# Altium schematic sheet [05] - CPU - HDMI, LVDS.SchDoc
size A2; DocumentNumber: 5; SheetNumber: 5; SheetTotal: 32
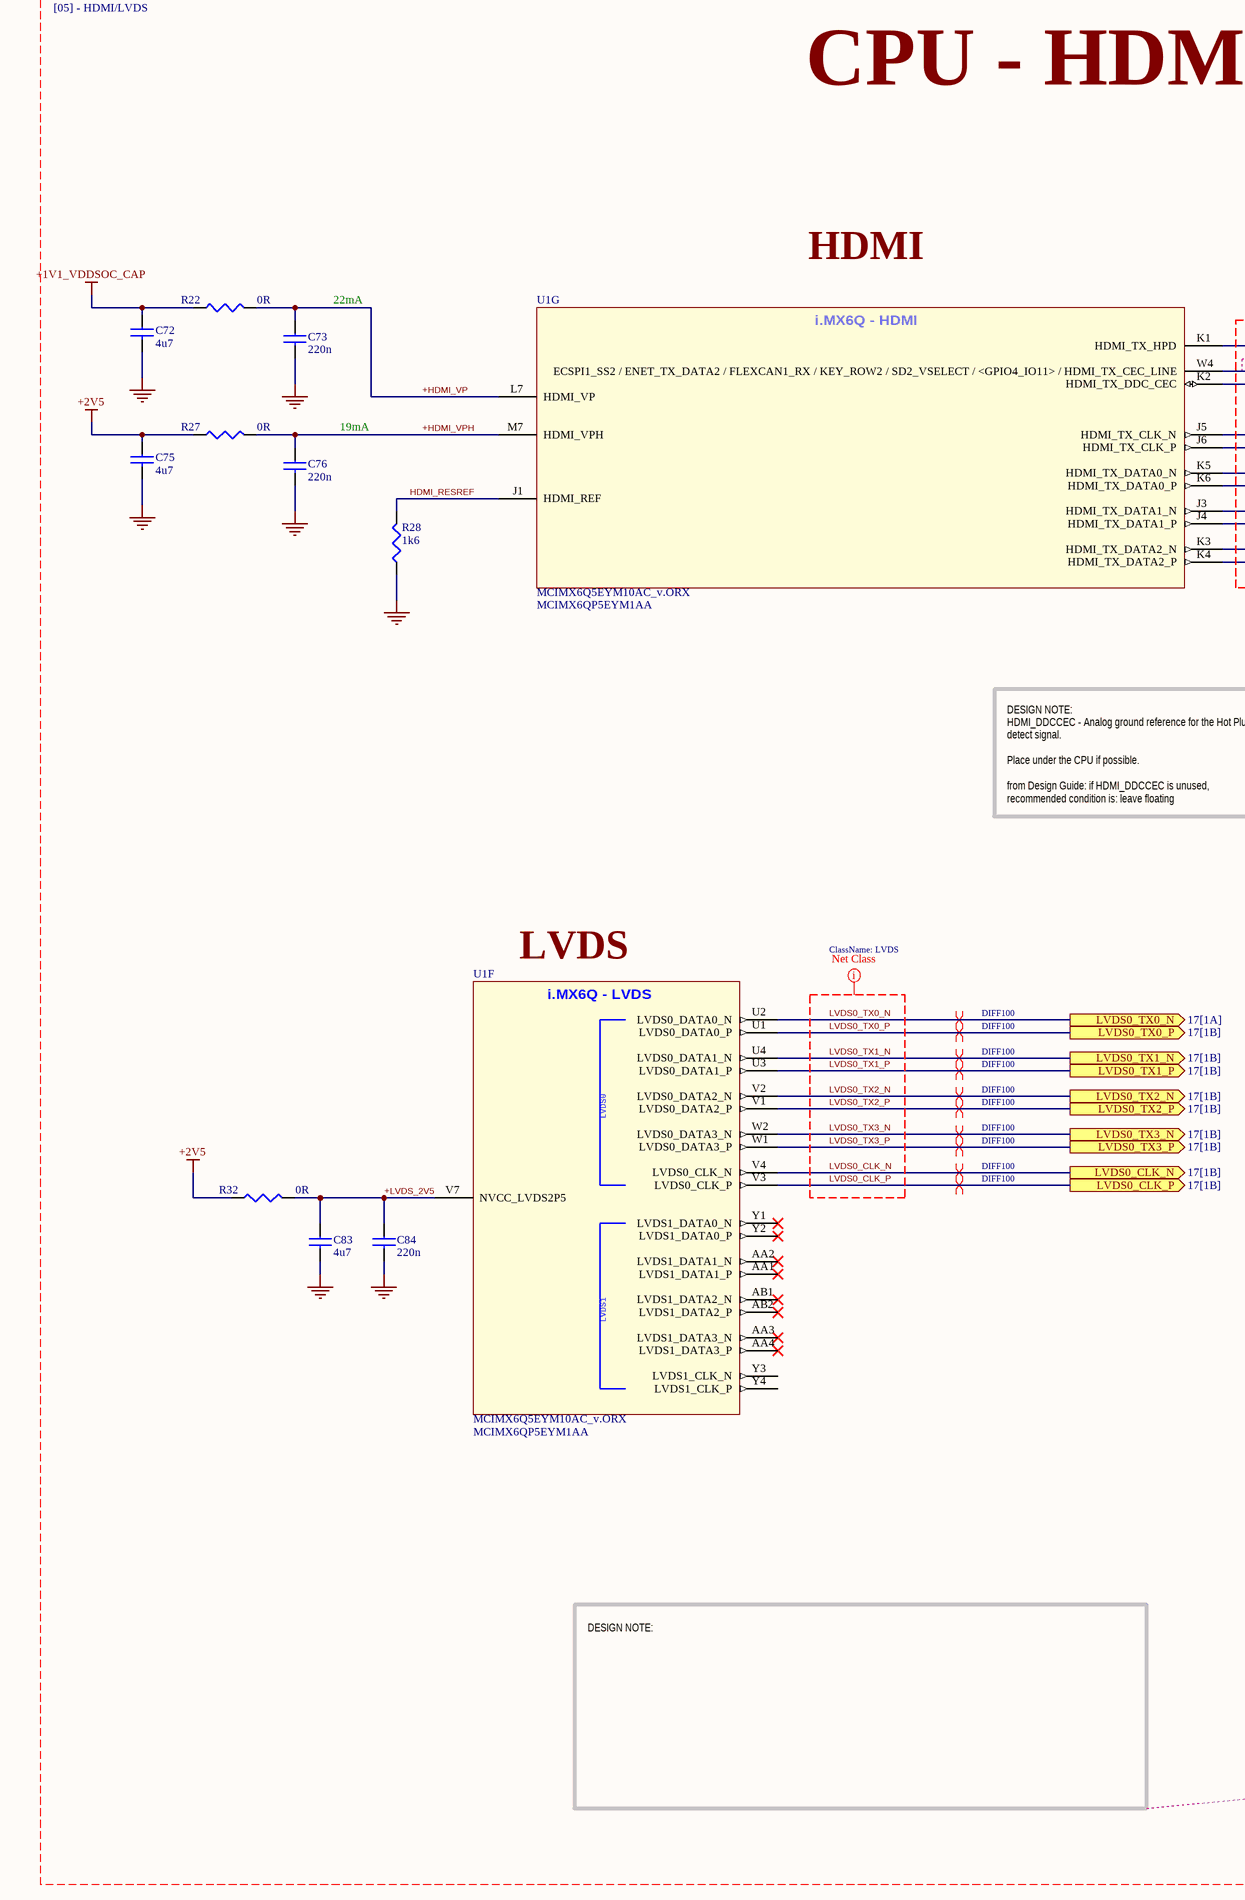
[diagram p0: [05] - CPU - HDMI, LVDS.SchDoc, left]
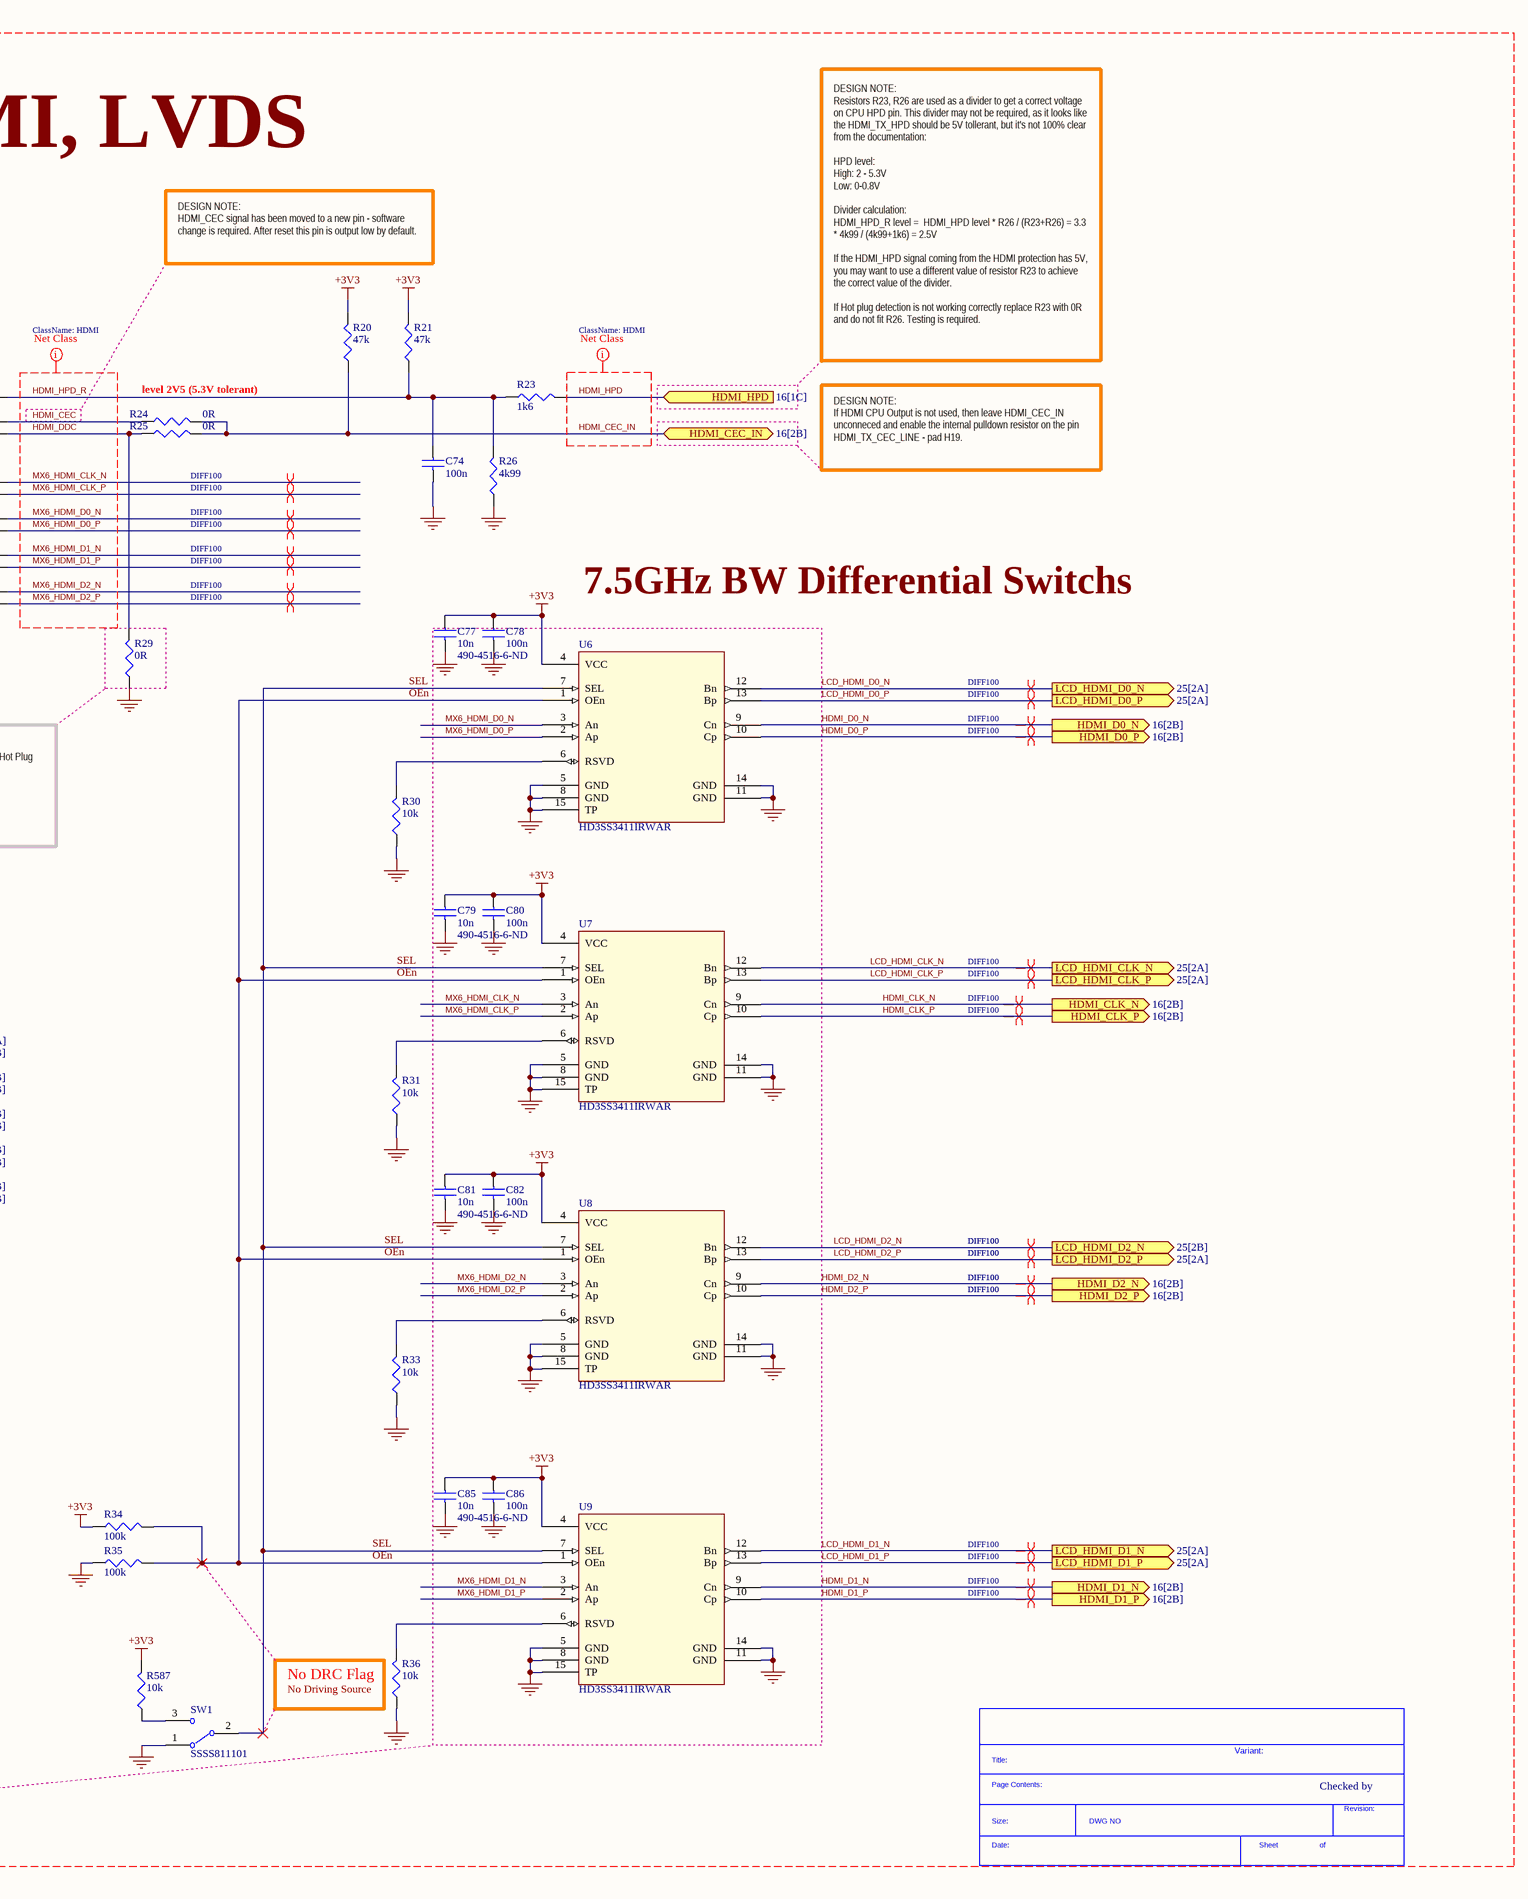
[diagram p1: [05] - CPU - HDMI, LVDS.SchDoc, right]

## Parts
*  SDTitleBlock  (value not drawn)  (graphical)
C72  4u7  [C0402]
C73  220n  [C0201]
C74  100n  [C0402]
C75  4u7  [C0402]
C76  220n  [C0201]
C77  10n  Supplier Part Number 2: 490-4516-6-ND  [C0402]
C78  100n  [C0402]
C79  10n  Supplier Part Number 2: 490-4516-6-ND  [C0402]
C80  100n  [C0402]
C81  10n  Supplier Part Number 2: 490-4516-6-ND  [C0402]
C82  100n  [C0402]
C83  4u7  [C0402]
C84  220n  [C0201]
C85  10n  Supplier Part Number 2: 490-4516-6-ND  [C0402]
C86  100n  [C0402]
R20  47k  [R0402]
R21  47k  [R0402]
R22  0R  [R0402]
R23  1k6  [R0402]
R24  0R  [R0402]
R25  0R  [R0402]
R26  4k99  [R0402]
R27  0R  [R0402]
R28  1k6  [R0201]
R29  0R  [R0402]
R30  10k  [R0201]
R31  10k  [R0201]
R32  0R  [R0402]
R33  10k  [R0201]
R34  100k  [R0402]
R35  100k  [R0402]
R36  10k  [R0201]
R587  10k  [R0201]
SW1  SSSS811101  [SSSS811101]
U1  MCIMX6Q5EYM10AC_v.ORX  Supplier Part Number 2: MCIMX6QP5EYM1AA  [PBGA624]  (parts F,G of 23)
U6  HD3SS3411IRWAR  [QFN50P330X330X80_HS-15N]
U7  HD3SS3411IRWAR  [QFN50P330X330X80_HS-15N]
U8  HD3SS3411IRWAR  [QFN50P330X330X80_HS-15N]
U9  HD3SS3411IRWAR  [QFN50P330X330X80_HS-15N]

## Ports
HDMI_CEC_IN (bidir, see 16[2B]), HDMI_CLK_N (out, see 16[2B]), HDMI_CLK_P (out, see 16[2B]), HDMI_D0_N (out, see 16[2B]), HDMI_D0_P (out, see 16[2B]), HDMI_D1_N (out, see 16[2B]), HDMI_D1_P (out, see 16[2B]), HDMI_D2_N (out, see 16[2B]), HDMI_D2_P (out, see 16[2B]), HDMI_HPD (in, see 16[1C]), LCD_HDMI_CLK_N (out, see 25[2A]), LCD_HDMI_CLK_P (out, see 25[2A]), LCD_HDMI_D0_N (out, see 25[2A]), LCD_HDMI_D0_P (out, see 25[2A]), LCD_HDMI_D1_N (out, see 25[2A]), LCD_HDMI_D1_P (out, see 25[2A]), LCD_HDMI_D2_N (out, see 25[2B]), LCD_HDMI_D2_P (out, see 25[2A]), LVDS0_CLK_N (out, see 17[1B]), LVDS0_CLK_P (out, see 17[1B]), LVDS0_TX0_N (out, see 17[1A]), LVDS0_TX0_P (out, see 17[1B]), LVDS0_TX1_N (out, see 17[1B]), LVDS0_TX1_P (out, see 17[1B]), LVDS0_TX2_N (out, see 17[1B]), LVDS0_TX2_P (out, see 17[1B]), LVDS0_TX3_N (out, see 17[1B]), LVDS0_TX3_P (out, see 17[1B])

## Nets
+1V1_VDDSOC_CAP: C72.1 R22.1
+2V5: C75.1 R27.1 R32.1
+3V3: C77.1 C78.1 C79.1 C80.1 C81.1 C82.1 C85.1 C86.1 R20.2 R21.2 R34.1 R587.2 U6.4(VCC) U7.4(VCC) U8.4(VCC) U9.4(VCC)
GND: C72.2 C73.2 C74.2 C75.2 C76.2 C77.2 C78.2 C79.2 C80.2 C81.2 C82.2 C83.2 C84.2 C85.2 C86.2 R26.1 R28.1 R29.1 R30.1 R31.1 R33.1 R35.1 R36.1 SW1.1 U6.5(GND) U6.8(GND) U6.11(GND) U6.14(GND) U6.15(TP) U7.5(GND) U7.8(GND) U7.11(GND) U7.14(GND) U7.15(TP) U8.5(GND) U8.8(GND) U8.11(GND) U8.14(GND) U8.15(TP) U9.5(GND) U9.8(GND) U9.11(GND) U9.14(GND) U9.15(TP)
+HDMI_VP: C73.1 R22.2 U1.L7(HDMI_VP)
+HDMI_VPH: C76.1 R27.2 U1.M7(HDMI_VPH)
+LVDS_2V5: C83.1 C84.1 R32.2 U1.V7(NVCC_LVDS2P5)
HDMI_CEC: R24.1 U1.W4(ECSPI1_SS2_/_ENET_TX_DATA2_/_FLEXCAN1_RX_/_KEY_ROW2_/_SD2_VSELECT_/_<GPIO4_IO11>_/_HDMI_TX_CEC_LINE)
HDMI_CEC_IN: R20.1 R24.2 R25.2 ; port HDMI_CEC_IN
HDMI_CLK_N: U7.9(Cn) ; port HDMI_CLK_N
HDMI_CLK_P: U7.10(Cp) ; port HDMI_CLK_P
HDMI_D0_N: U6.9(Cn) ; port HDMI_D0_N
HDMI_D0_P: U6.10(Cp) ; port HDMI_D0_P
HDMI_D1_N: U9.9(Cn) ; port HDMI_D1_N
HDMI_D1_P: U9.10(Cp) ; port HDMI_D1_P
HDMI_D2_N: U8.9(Cn) ; port HDMI_D2_N
HDMI_D2_P: U8.10(Cp) ; port HDMI_D2_P
HDMI_DDC: R25.1 R29.2 U1.K2(HDMI_TX_DDC_CEC)
HDMI_HPD: R23.2 ; port HDMI_HPD
HDMI_HPD_R: C74.1 R21.1 R23.1 R26.2 U1.K1(HDMI_TX_HPD)
HDMI_RESREF: R28.2 U1.J1(HDMI_REF)
LCD_HDMI_CLK_N: U7.12(Bn) ; port LCD_HDMI_CLK_N
LCD_HDMI_CLK_P: U7.13(Bp) ; port LCD_HDMI_CLK_P
LCD_HDMI_D0_N: U6.12(Bn) ; port LCD_HDMI_D0_N
LCD_HDMI_D0_P: U6.13(Bp) ; port LCD_HDMI_D0_P
LCD_HDMI_D1_N: U9.12(Bn) ; port LCD_HDMI_D1_N
LCD_HDMI_D1_P: U9.13(Bp) ; port LCD_HDMI_D1_P
LCD_HDMI_D2_N: U8.12(Bn) ; port LCD_HDMI_D2_N
LCD_HDMI_D2_P: U8.13(Bp) ; port LCD_HDMI_D2_P
LVDS0_CLK_N: U1.V4(LVDS0_CLK_N) ; port LVDS0_CLK_N
LVDS0_CLK_P: U1.V3(LVDS0_CLK_P) ; port LVDS0_CLK_P
LVDS0_TX0_N: U1.U2(LVDS0_DATA0_N) ; port LVDS0_TX0_N
LVDS0_TX0_P: U1.U1(LVDS0_DATA0_P) ; port LVDS0_TX0_P
LVDS0_TX1_N: U1.U4(LVDS0_DATA1_N) ; port LVDS0_TX1_N
LVDS0_TX1_P: U1.U3(LVDS0_DATA1_P) ; port LVDS0_TX1_P
LVDS0_TX2_N: U1.V2(LVDS0_DATA2_N) ; port LVDS0_TX2_N
LVDS0_TX2_P: U1.V1(LVDS0_DATA2_P) ; port LVDS0_TX2_P
LVDS0_TX3_N: U1.W2(LVDS0_DATA3_N) ; port LVDS0_TX3_N
LVDS0_TX3_P: U1.W1(LVDS0_DATA3_P) ; port LVDS0_TX3_P
MX6_HDMI_CLK_N: U1.J5(HDMI_TX_CLK_N) U7.3(An)
MX6_HDMI_CLK_P: U1.J6(HDMI_TX_CLK_P) U7.2(Ap)
MX6_HDMI_D0_N: U1.K5(HDMI_TX_DATA0_N) U6.3(An)
MX6_HDMI_D0_P: U1.K6(HDMI_TX_DATA0_P) U6.2(Ap)
MX6_HDMI_D1_N: U1.J3(HDMI_TX_DATA1_N) U9.3(An)
MX6_HDMI_D1_P: U1.J4(HDMI_TX_DATA1_P) U9.2(Ap)
MX6_HDMI_D2_N: U1.K3(HDMI_TX_DATA2_N) U8.3(An)
MX6_HDMI_D2_P: U1.K4(HDMI_TX_DATA2_P) U8.2(Ap)
OEn: R34.2 R35.2 U6.1(OEn) U7.1(OEn) U8.1(OEn) U9.1(OEn)
SEL: SW1.2 U6.7(SEL) U7.7(SEL) U8.7(SEL) U9.7(SEL)
NetR30_2: R30.2 U6.6(RSVD)
NetR31_2: R31.2 U7.6(RSVD)
NetR33_2: R33.2 U8.6(RSVD)
NetR36_2: R36.2 U9.6(RSVD)
NetR587_1: R587.1 SW1.3

Not connected (* = marked no-connect by the designer): U1 AA1(LVDS1_DATA1_P)* AA2(LVDS1_DATA1_N)* AA3(LVDS1_DATA3_N)* AA4(LVDS1_DATA3_P)* AB1(LVDS1_DATA2_N)* AB2(LVDS1_DATA2_P)* Y1(LVDS1_DATA0_N)* Y2(LVDS1_DATA0_P)* Y3(LVDS1_CLK_N) Y4(LVDS1_CLK_P)

## Layout directives
differential pair; net class DIFF100: HDMI_CLK_N, HDMI_CLK_P, HDMI_D0_N, HDMI_D0_P, HDMI_D1_N, HDMI_D1_P, HDMI_D2_N, HDMI_D2_P, LCD_HDMI_CLK_N, LCD_HDMI_CLK_P, LCD_HDMI_D0_N, LCD_HDMI_D0_P, LCD_HDMI_D1_N, LCD_HDMI_D1_P, LCD_HDMI_D2_N, LCD_HDMI_D2_P, LVDS0_CLK_N, LVDS0_CLK_P, LVDS0_TX0_N, LVDS0_TX0_P, LVDS0_TX1_N, LVDS0_TX1_P, LVDS0_TX2_N, LVDS0_TX2_P, LVDS0_TX3_N, LVDS0_TX3_P, MX6_HDMI_CLK_N, MX6_HDMI_CLK_P, MX6_HDMI_D0_N, MX6_HDMI_D0_P, MX6_HDMI_D1_N, MX6_HDMI_D1_P, MX6_HDMI_D2_N, MX6_HDMI_D2_P
net class HDMI: HDMI_CEC, HDMI_CEC_IN, HDMI_DDC, HDMI_HPD, HDMI_HPD_R, MX6_HDMI_CLK_N, MX6_HDMI_CLK_P, MX6_HDMI_D0_N, MX6_HDMI_D0_P, MX6_HDMI_D1_N, MX6_HDMI_D1_P, MX6_HDMI_D2_N, MX6_HDMI_D2_P
net class [05] - HDMI/LVDS: +1V1_VDDSOC_CAP, +2V5, +3V3, +HDMI_VP, +HDMI_VPH, +LVDS_2V5, GND, HDMI_CEC, HDMI_CEC_IN, HDMI_CLK_N, HDMI_CLK_P, HDMI_D0_N, HDMI_D0_P, HDMI_D1_N, HDMI_D1_P, HDMI_D2_N, HDMI_D2_P, HDMI_DDC, HDMI_HPD, HDMI_HPD_R, HDMI_RESREF, LCD_HDMI_CLK_N, LCD_HDMI_CLK_P, LCD_HDMI_D0_N, LCD_HDMI_D0_P, LCD_HDMI_D1_N, LCD_HDMI_D1_P, LCD_HDMI_D2_N, LCD_HDMI_D2_P, LVDS0_CLK_N, LVDS0_CLK_P, LVDS0_TX0_N, LVDS0_TX0_P, LVDS0_TX1_N, LVDS0_TX1_P, LVDS0_TX2_N, LVDS0_TX2_P, LVDS0_TX3_N, LVDS0_TX3_P, MX6_HDMI_CLK_N, MX6_HDMI_CLK_P, MX6_HDMI_D0_N, MX6_HDMI_D0_P, MX6_HDMI_D1_N, MX6_HDMI_D1_P, MX6_HDMI_D2_N, MX6_HDMI_D2_P, OEn, SEL
net class LVDS: LVDS0_CLK_N, LVDS0_CLK_P, LVDS0_TX0_N, LVDS0_TX0_P, LVDS0_TX1_N, LVDS0_TX1_P, LVDS0_TX2_N, LVDS0_TX2_P, LVDS0_TX3_N, LVDS0_TX3_P

## Notes on the sheet
- CPU - HDMI, LVDS
- DESIGN NOTE:
  HDMI_CEC signal has been moved to a new pin - software change is required. After reset this pin is output low by default.
- HDMI
- (near C73) 22mA
- level 2V5 (5.3V tolerant)
- DESIGN NOTE:
  Resistors R23, R26 are used as a divider to get a correct voltage on CPU HPD pin. This divider may not be required, as it looks like the HDMI_TX_HPD should be 5V tollerant, but it's not 100% clear from the documentation:
  HPD level:
  High: 2 - 5.3V
  Low: 0-0.8V
  Divider calculation:
  HDMI_HPD_R level =  HDMI_HPD level * R26 / (R23+R26) = 3.3 * 4k99 / (4k99+1k6) = 2.5V
  If the HDMI_HPD signal coming from the HDMI protection has 5V, you may want to use a different value of resistor R23 to achieve the correct value of the divider.
  If Hot plug detection is not working correctly replace R23 with 0R and do not fit R26. Testing is required.
- DESIGN NOTE:
  If HDMI CPU Output is not used, then leave HDMI_CEC_IN unconneced and enable the internal pulldown resistor on the pin HDMI_TX_CEC_LINE - pad H19.
- 19mA
- 7.5GHz BW Differential Switchs
- DESIGN NOTE:
  HDMI_DDCCEC - Analog ground reference for the Hot Plug detect signal.
  Place under the CPU if possible.
  from Design Guide: if HDMI_DDCCEC is unused, recommended condition is: leave floating
- LVDS
- DESIGN NOTE:
- (near R36) No DRC Flag
- (near R36) No Driving Source
- Variant:
- Checked by
- (in symbol MCIMX6Q5EYM10AC_v.ORX, part F) i.MX6Q - LVDS; LVDS0; LVDS1
- (in symbol MCIMX6Q5EYM10AC_v.ORX, part G) i.MX6Q - HDMI
- (in symbol SDTitleBlock) Title:; Page Contents:; Revision:; Size:; DWG NO; Date:; Sheet; of

## Library data of the parts
C72 C75 C83 = C1005X5R1A475M: CAP CER 4.7UF 10V 20% X5R 0402; Manufacturer: TDK Corporation; Capacitance: 4.7µF; .Checked PCB: used; Supplier 1: Digi-Key; Supplier Part Number 1: 445-8023-1-ND; Manufacturer Part Number: C1005X5R1A475M; RoHS: RoHS Compliant; Category: Capacitors; Stock 1: 10140; Pricing 1: 1=0.53, 10=0.415, 100=0.25, 250=0.18752, 500=0.16, 1000=0.125, 5000=0.095 (USD); Voltage - Rated: 10V; Tolerance: ±20%; Temperature Coefficient: X5R; Mounting Type: Surface Mount, MLCC; Operating Temperature: -55°C ~ 85°C; Applications: General Purpose; Ratings: -; Package / Case: 0402 (1005 Metric); Size / Dimension: 0.039" L x 0.020" W (1.00mm x 0.50mm); Height - Seated (Max): -; Thickness (Max): -; Lead Spacing: -; Features: -; Packaging: Cut Tape (CT); Lead Style: -; ComponentLink1URL: http://www.tdk.com/pdf/general_B11.pdf; ComponentLink1Description: http://www.tdk.com/pdf/general_B11.pdf; .Checked SCH: used
C73 C76 C84 = C0603X5R0J224M030BB: CAP CER 0.22UF 6.3V 20% X5R 0201; Manufacturer: TDK Corporation; Capacitance: 0.22µF; .Checked PCB: used; .Creator: MM; Supplier 1: Digi-Key; Manufacturer Part Number: C0603X5R0J224M030BB; RoHS: RoHS Compliant; Category: Capacitors; Stock 1: 205900; Pricing 1: 1=0.15, 10=0.102, 100=0.0485, 250=0.0408, 500=0.03418, 1000=0.0275, 5000=0.02325 (USD); Packaging: Cut Tape (CT); Tolerance: ±20%; Voltage - Rated: 6.3V; Temperature Coefficient: X5R; Mounting Type: Surface Mount, MLCC; Operating Temperature: -55°C ~ 85°C; Applications: General Purpose; Ratings: -; Package / Case: 0201 (0603 Metric); Size / Dimension: 0.024" L x 0.012" W (0.60mm x 0.30mm); Height - Seated (Max): -; Thickness (Max): 0.013" (0.33mm); Lead Spacing: -; Features: -; Lead Style: -; ComponentLink1URL: http://product.tdk.com/en/catalog/datasheets/mlcc_commercial_general_en.pdf; ComponentLink1Description: http://product.tdk.com/en/catalog/datasheets/mlcc_commercial_general_en.pdf; Supplier Part Number 1: 445-5929-1-ND; .Checked SCH: used; Supplier 2: Digi-Key; Supplier Part Number 2: 1276-1042-6-ND
C74 C78 C80 C82 C86 = C1005X5R1H104K: CAP CER .10UF 50V X5R 10% 0402; Manufacturer: TDK Corporation; Capacitance: 0.1µF; Value: 100nF; .Checked PCB: used; Category: Capacitors; Supplier Part Number: 445-5942-1-ND; Manufacturer Part Number: C1005X5R1H104K; Operating Temperature: -55°C ~ 85°C; Package / Case: 0402 (1005 Metric); Price 1k [$]: 0.02340; .Checked SCH: used; Voltage - Rated: 50V; Supplier: Digikey; Supplier 1: Digi-Key; Supplier Part Number 1: 445-5942-1-ND; RoHS: RoHS Compliant; Stock 1: 106926; Pricing 1: 1=0.27, 10=0.18, 100=0.072, 250=0.05176, 500=0.0369, 1000=0.027 (USD); Tolerance: ±10%; Temperature Coefficient: X5R; Mounting Type: Surface Mount, MLCC; Applications: General Purpose; Ratings: -; Size / Dimension: 0.039" L x 0.020" W (1.00mm x 0.50mm); Height - Seated (Max): -; Thickness (Max): 0.022" (0.55mm); Lead Spacing: -; Features: -; Packaging: Cut Tape (CT); Lead Style: -; ComponentLink1URL: http://www.tdk.co.jp/tefe02/e412_c.pdf; ComponentLink1Description: http://www.tdk.co.jp/tefe02/e412_c.pdf; Supplier 2: Digi-Key; Supplier Part Number 2: 311-1697-6-ND
C77 C79 C81 C85 = C1005X7R1H103K: CAP CER 10000PF 50V 10% X7R 0402; Manufacturer: TDK Corporation; Value: 10nF; .Checked PCB: used; Capacitance: 10000pF; Category: Capacitors; Supplier Part Number: 445-6850-1-ND; Manufacturer Part Number: C1005X7R1H103K; Operating Temperature: -55°C ~ 125°C; Package / Case: 0402 (1005 Metric); Price 1k [$]: 0.01625; .Checked SCH: used; Voltage - Rated: 50V; Supplier: Digikey; Supplier 1: Digi-Key; Supplier Part Number 1: 445-6850-1-ND; RoHS: RoHS Compliant; Stock 1: 3901; Pricing 1: 1=0.2, 10=0.125, 100=0.045, 250=0.03252, 500=0.024, 1000=0.01625 (USD); Tolerance: ±10%; Temperature Coefficient: X7R; Mounting Type: Surface Mount, MLCC; Applications: General Purpose; Ratings: -; Size / Dimension: 0.039" L x 0.020" W (1.00mm x 0.50mm); Height - Seated (Max): -; Thickness (Max): 0.022" (0.55mm); Lead Spacing: -; Features: -; Packaging: Cut Tape (CT); Lead Style: -; ComponentLink1URL: http://www.tdk.co.jp/tefe02/e412_c.pdf; ComponentLink1Description: http://www.tdk.co.jp/tefe02/e412_c.pdf; Supplier 2: Digi-Key
R20 R21 = RC0402FR-0747KL: RES 47.0K OHM 1/16W 1% 0402 SMD; Manufacturer: Yageo; Power (Watts): 0.063W, 1/16W; .Checked PCB: used; Temperature Coefficient: ±100ppm/°C; Category: Resistors; Supplier Part Number: 311-47.0KLRCT-ND; Manufacturer Part Number: RC0402FR-0747KL; Package / Case: 0402 (1005 Metric); Price 1k [$]: 0.01421; Resistance (Ohms): 47K; Tolerance: ±1%; Value: 47k; .Checked SCH: used; Supplier: Digikey; Supplier 1: Digi-Key; Supplier Part Number 1: 311-47.0KLRCT-ND; RoHS: RoHS Compliant; Stock 1: 1227580; Pricing 1: 10=0.014, 50=0.0104, 100=0.0079, 250=0.00584, 500=0.00432, 1000=0.00288 (USD); Composition: Thick Film; Features: -; Size / Dimension: 0.039" L x 0.020" W (1.00mm x 0.50mm); Height: 0.016" (0.40mm); Number of Terminations: 2; Packaging: Cut Tape (CT); ComponentLink1URL: http://www.yageo.com/documents/recent/PYu-RC0402_51_RoHS_L_6.pdf; ComponentLink1Description: http://www.yageo.com/documents/recent/PYu-RC0402_51_RoHS_L_6.pdf; Supplier 2: Digi-Key; Supplier Part Number 2: 1276-3467-1-ND
R22 R24 R25 R27 R29 R32 = RC0402JR-070RL: RES 0.0 OHM 1/16W 0402 SMD; Manufacturer: Yageo; Resistance (Ohms): 0.0; Power (Watts): 0.063W, 1/16W; Tolerance: Jumper; .Checked PCB: used; Category: Resistors; Supplier Part Number: 311-0.0JRCT-ND; Manufacturer Part Number: RC0402JR-070RL; Package / Case: 0402 (1005 Metric); Price 1k [$]: 0.01389; Value: 0R; .Checked SCH: used; Supplier: Digikey; Supplier 1: Digi-Key; Supplier Part Number 1: 311-0.0JRCT-ND; RoHS: RoHS Compliant; Stock 1: 1106330; Pricing 1: 10=0.012, 50=0.009, 100=0.0069, 250=0.00512, 500=0.0038, 1000=0.00253 (USD); Composition: Thick Film; Features: -; Temperature Coefficient: -; Size / Dimension: 0.039" L x 0.020" W (1.00mm x 0.50mm); Height: 0.016" (0.40mm); Number of Terminations: 2; Packaging: Cut Tape (CT); ComponentLink1URL: http://www.yageo.com/documents/recent/PYu-RC0402_51_RoHS_L_6.pdf; ComponentLink1Description: http://www.yageo.com/documents/recent/PYu-RC0402_51_RoHS_L_6.pdf
R23 = ERJ-2RKF1601X: RES 1.6K OHM 1/10W 1% 0402 SMD; Manufacturer: Panasonic Electronic Components; Power (Watts): 0.1W, 1/10W; Temperature Coefficient: ±100ppm/°C; .Creator: MM; .Checked PCB: used; Supplier 1: Digi-Key; Manufacturer Part Number: ERJ-2RKF1601X; RoHS: RoHS Compliant; Category: Resistors; Stock 1: 89488; Pricing 1: 1=0.1, 50=0.0242, 100=0.0184, 250=0.01364, 500=0.01008, 1000=0.00672, 5000=0.00473 (USD); Resistance (Ohms): 1.6k; Composition: Thick Film; Features: -; Tolerance: ±1%; Package / Case: 0402 (1005 Metric); Supplier Device Package: 0402; Size / Dimension: 0.039" L x 0.020" W (1.00mm x 0.50mm); Height: 0.016" (0.40mm); Number of Terminations: 2; Packaging: Cut Tape (CT); ComponentLink1URL: http://industrial.panasonic.com/www-cgi/jvcr13pz.cgi?E+PZ+3+AOA0002+ERJ2RKF1601X+7+WW; ComponentLink1Description: http://industrial.panasonic.com/www-cgi/jvcr13pz.cgi?E+PZ+3+AOA0002+ERJ2RKF1601X+7+WW; Supplier Part Number 1: P1.60KLCT-ND; .Checked SCH: used
R26 = RMCF0402FT4K99: RES TF 4.99K OHM 1% 1/16W 0402; Manufacturer: Stackpole Electronics Inc; Power (Watts): 0.063W, 1/16W; .Checked PCB: used; Temperature Coefficient: ±100ppm/°C; Category: Resistors; Supplier Part Number: RMCF0402FT4K99CT-ND; Manufacturer Part Number: RMCF0402FT4K99; Package / Case: 0402 (1005 Metric); Price 1k [$]: 0.00384; Resistance (Ohms): 4.99K; Tolerance: ±1%; Value: 4k99; .Checked SCH: used; Supplier: Digikey; Supplier 1: Digi-Key; Supplier Part Number 1: RMCF0402FT4K99CT-ND; RoHS: RoHS Compliant; Stock 1: 48509; Pricing 1: 1=0.04, 10=0.025, 50=0.0138, 100=0.0105, 250=0.0078, 500=0.00576, 1000=0.00384 (USD); Composition: Thick Film; Features: -; Size / Dimension: 0.039" L x 0.020" W (1.00mm x 0.50mm); Height: 0.016" (0.40mm); Number of Terminations: 2; Packaging: Cut Tape (CT); ComponentLink1URL: http://www.seielect.com/Catalog/SEI-RMCF.pdf; ComponentLink1Description: http://www.seielect.com/Catalog/SEI-RMCF.pdf
R28 = CRCW02011K60FKED: RES 1.60K OHM 1/20W 1% 0201 SMD; Manufacturer: Vishay Dale; Resistance (Ohms): 1.6k; Power (Watts): 0.05W, 1/20W; Temperature Coefficient: ±100ppm/°C; .Creator: MM; .Checked PCB: used; Supplier 1: Digi-Key; Manufacturer Part Number: CRCW02011K60FKED; RoHS: RoHS Compliant; Category: Resistors; Stock 1: 31501; Pricing 1: 1=0.26, 10=0.218, 25=0.1584, 50=0.1148, 100=0.0851, 250=0.06536, 500=0.05148, 1000=0.03564, 2500=0.03267 (USD); Packaging: Cut Tape (CT); Tolerance: ±1%; Composition: Thick Film; Features: -; Package / Case: 0201 (0603 Metric); Supplier Device Package: 0201 (0603 Metric); Size / Dimension: 0.024" L x 0.012" W (0.60mm x 0.30mm); Height: 0.011" (0.28mm); Number of Terminations: 2; ComponentLink1URL: http://www.vishay.com/docs/20052/crcw0201e3.pdf; ComponentLink1Description: http://www.vishay.com/docs/20052/crcw0201e3.pdf; Supplier Part Number 1: 541-1.60KAABCT-ND; .Checked SCH: used
R30 R31 R33 R36 R587 = RC0201FR-0710KL: RES 10K OHM 1/20W 1% 0201 SMD; Manufacturer: Yageo; Power (Watts): 0.05W, 1/20W; Temperature Coefficient: ±200ppm/°C; .Creator: MM; .Checked PCB: used; Supplier 1: Digi-Key; Manufacturer Part Number: RC0201FR-0710KL; RoHS: RoHS Compliant; Category: Resistors; Stock 1: 529049; Pricing 1: 1=0.1, 10=0.074, 25=0.054, 100=0.0303, 250=0.02312, 500=0.0185, 1000=0.01361, 2500=0.01182, 5000=0.00976 (USD); Packaging: Cut Tape (CT); Resistance (Ohms): 10k; Tolerance: ±1%; Composition: Thick Film; Features: Moisture Resistant; Package / Case: 0201 (0603 Metric); Supplier Device Package: 0201; Size / Dimension: 0.024" L x 0.012" W (0.60mm x 0.30mm); Height: 0.010" (0.26mm); Number of Terminations: 2; ComponentLink1URL: http://www.yageo.com/documents/recent/PYu-RC0201_51_RoHS_L_8.pdf; ComponentLink1Description: http://www.yageo.com/documents/recent/PYu-RC0201_51_RoHS_L_8.pdf; Supplier Part Number 1: 311-10.0KMCT-ND; .Checked SCH: used; Supplier 2: Digi-Key; Supplier Part Number 2: 541-10.0KABCT-ND
R34 R35 = RMCF0402FT100K: RES 100K OHM 1/16W 1% 0402 SMD; Manufacturer: Stackpole Electronics Inc; Power (Watts): 0.063W, 1/16W; .Checked PCB: used; Temperature Coefficient: ±100ppm/°C; Category: Resistors; Supplier Part Number: RMCF0402FT100KCT-ND; Manufacturer Part Number: RMCF0402FT100K; Package / Case: 0402 (1005 Metric); Price 1k [$]: 0.00384; Resistance (Ohms): 100K; Tolerance: ±1%; Value: 100k; .Checked SCH: used; Supplier: Digikey; Supplier 1: Digi-Key; Supplier Part Number 1: YAG1343DKR-ND; RoHS: RoHS Compliant; Composition: Thick Film; Features: -; Size / Dimension: 0.039" L x 0.020" W (1.00mm x 0.50mm); Height: 0.016" (0.40mm); Number of Terminations: 2; Packaging: Cut Tape (CT); ComponentLink1URL: http://www.seielect.com/Catalog/SEI-RMCF.pdf; ComponentLink1Description: http://www.seielect.com/Catalog/SEI-RMCF.pdf
SW1 = SSSS811101: Slide Switches SPDT HORZ GRND 1.5mm; Manufacturer: Alps Electric; Mechanical Life: 10000Cycles; Throw Configuration: SP,SPDT; Max Voltage Rating (DC): 5V; Contact Current Rating: 300mA; Voltage Rating (AC): 4V; Contact Resistance: 70mR; Supplier 1: Mouser; Manufacturer Part Number: SSSS811101; Stock 1: 37406; Pricing 1: 1=0.97, 10=0.97, 50=0.819, 100=0.726, 1000=0.533, 10000=0.502 (USD); Mount: Surface Mount; Case/Package: SMD/SMT; Min Operating Temperature: -10°C; Max Operating Temperature: 85°C; Termination: Gull Wing; Packaging: Tape and Reel; Electrical Life: 10000Cycles; Orientation: Right Angle; Length: 7.7mm; Depth: 5mm; Radiation Hardening: No; Lead Free: Lead Free; ComponentLink1URL: https://datasheet.ciiva.com/18147/getdatasheetpartid-652127-18147399.pdf; ComponentLink1Description: https://datasheet.ciiva.com/18147/getdatasheetpartid-652127-18147399.pdf; ComponentLink2URL: https://datasheet.ciiva.com/16174/623ssss8-16174702.pdf; ComponentLink2Description: https://datasheet.ciiva.com/16174/623ssss8-16174702.pdf; .Checked PCH: *; .Checked SCH: *; .Creator: *; Supplier Part Number 1: 688-SSSS811101
U1 = MCIMX6Q5EYM10AC_v.ORX: IC MCU 32BIT ARM QUAD 624FCBGA; Manufacturer: Freescale Semiconductor; Speed: 1.0GHz; .Creator: MM; .Checked PCB: used; Core Processor: ARM® Cortex™-A9; Core Size: 32-Bit Quad-Core; Connectivity: CAN, EBI/EMI, ESAI, Ethernet, GPMI, I2C, MMC/SD, PCI, SATA, SPI, UART, USB, USB OTG; Peripherals: DMA, HDMI, I2S/SSI/AC97, MIPI CSI, MIMI DSI, MIPI HIS, PWM, WDT; Number of I /O: 224; Program Memory Type: External Program Memory; RAM Size: 256K x 8; Voltage - Supply (Vcc/Vdd): 0.925 V ~ 1.5 V; Oscillator Type: Internal; Supplier 1: Digi-Key; Manufacturer Part Number: MCIMX6Q5EYM10AC; RoHS: RoHS Compliant; Category: Integrated Circuits (ICs); Stock 1: 0; Pricing 1: 1=54.98, 10=51.922, 25=48.868, 100=30.5424 (USD); Packaging: Tray; Package / Case: 624-FBGA, FCBGA; ComponentLink1URL: http://cache.freescale.com/files/32bit/doc/data_sheet/IMX6DQCEC.pdf; ComponentLink1Description: Data Sheet; Supplier Part Number 1: MCIMX6Q5EYM10AC-ND; .Checked SCH: used; Program Memory Size: -; EEPROM Size: -; Data Converters: -; Operating Temperature: -20°C ~ 105°C; ComponentLink2Description: User Guide; ComponentLink2URL: file:///C:/Users/mbeach/Downloads/i.MX_Linux_User's_Guide.pdf; Supplier 2: Arrow
U6-U9 = HD3SS3411IRWAR: IC MUX 2:1 8 OHM 14WQFN; Manufacturer: Texas Instruments; On-State Resistance (Max): 8 Ohm; Channel-to-Channel Matching (&Delta;Ron): 500 mOhm (Max); Voltage - Supply, Single (V+): 3 V ~ 3.6 V; -3db Bandwidth: 7.5GHz; Crosstalk: -35dB @ 4Ghz; Supplier 1: Digi-Key; Manufacturer Part Number: HD3SS3411IRWAR; RoHS: RoHS Compliant; Category: Integrated Circuits (ICs); Stock 1: 260; Pricing 1: 1=2.01, 10=1.801, 100=1.448, 500=1.18966, 1000=0.98571 (USD); Packaging: Cut Tape (CT); Part Status: Active; Switch Circuit: -; Multiplexer/Demultiplexer Circuit: 2:1; Voltage - Supply, Dual (V±): -; Switch Time (Ton, Toff) (Max): -; Charge Injection: -; Channel Capacitance (CS(off), CD(off)): -; Current - Leakage (IS(off)) (Max): -; Operating Temperature: -40°C ~ 105°C (TA); Package / Case: 14-WFQFN Exposed Pad; Supplier Device Package: 14-WQFN (3.5x3.5); ComponentLink1URL: http://www.ti.com/lit/ds/symlink/hd3ss3411.pdf; ComponentLink1Description: http://www.ti.com/lit/ds/symlink/hd3ss3411.pdf; Supplier Part Number 1: 296-43743-1-ND